# Altium schematic sheet 02_Power_RFFE_diag.SchDoc: Power diagram
size A4; Organization: Lime Microsystems; Address1: Surrey Tech Centre; Address2: Guildford GU2 7YG; Address3: Surrey; Address4: United Kingdom; Revision: v1.1; SheetNumber: 2; SheetTotal: 12
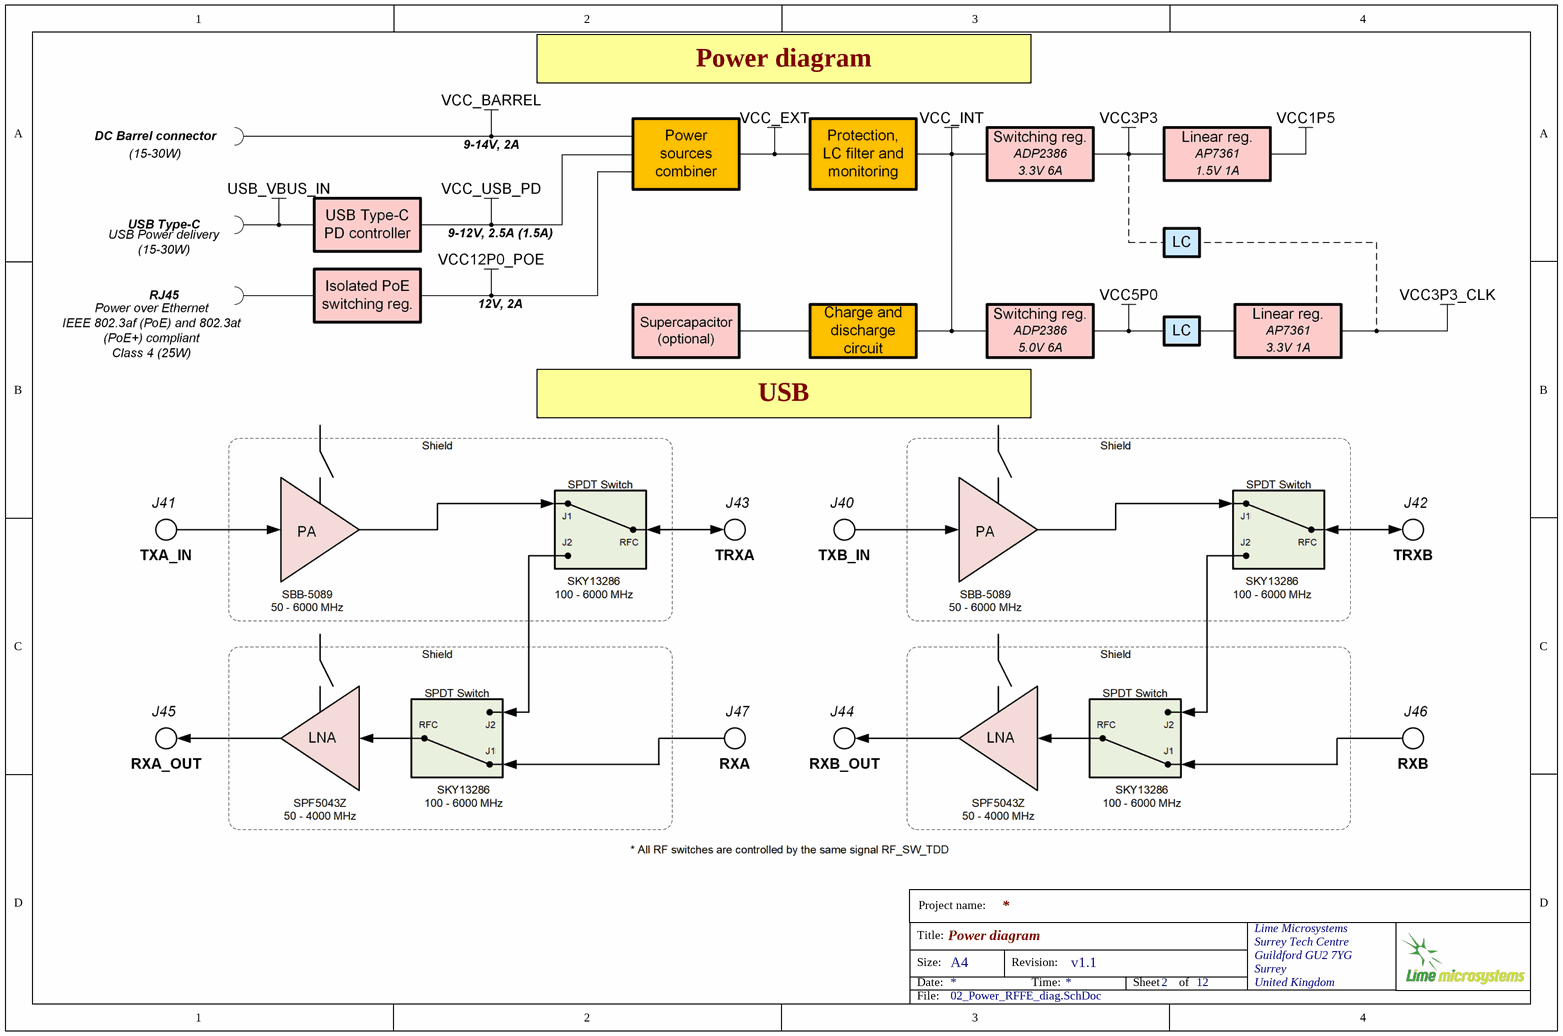
[diagram p0: 02_Power_RFFE_diag.SchDoc]

## Notes on the sheet
- Power diagram
- USB
- Project name:
- Title:
- Size:
- Date:
- A4
- Revision:
- Time:
- Sheet
- of
- File: